# EAGLE schematic mikrophonie_2_r2 (EAGLE 6.5.0)
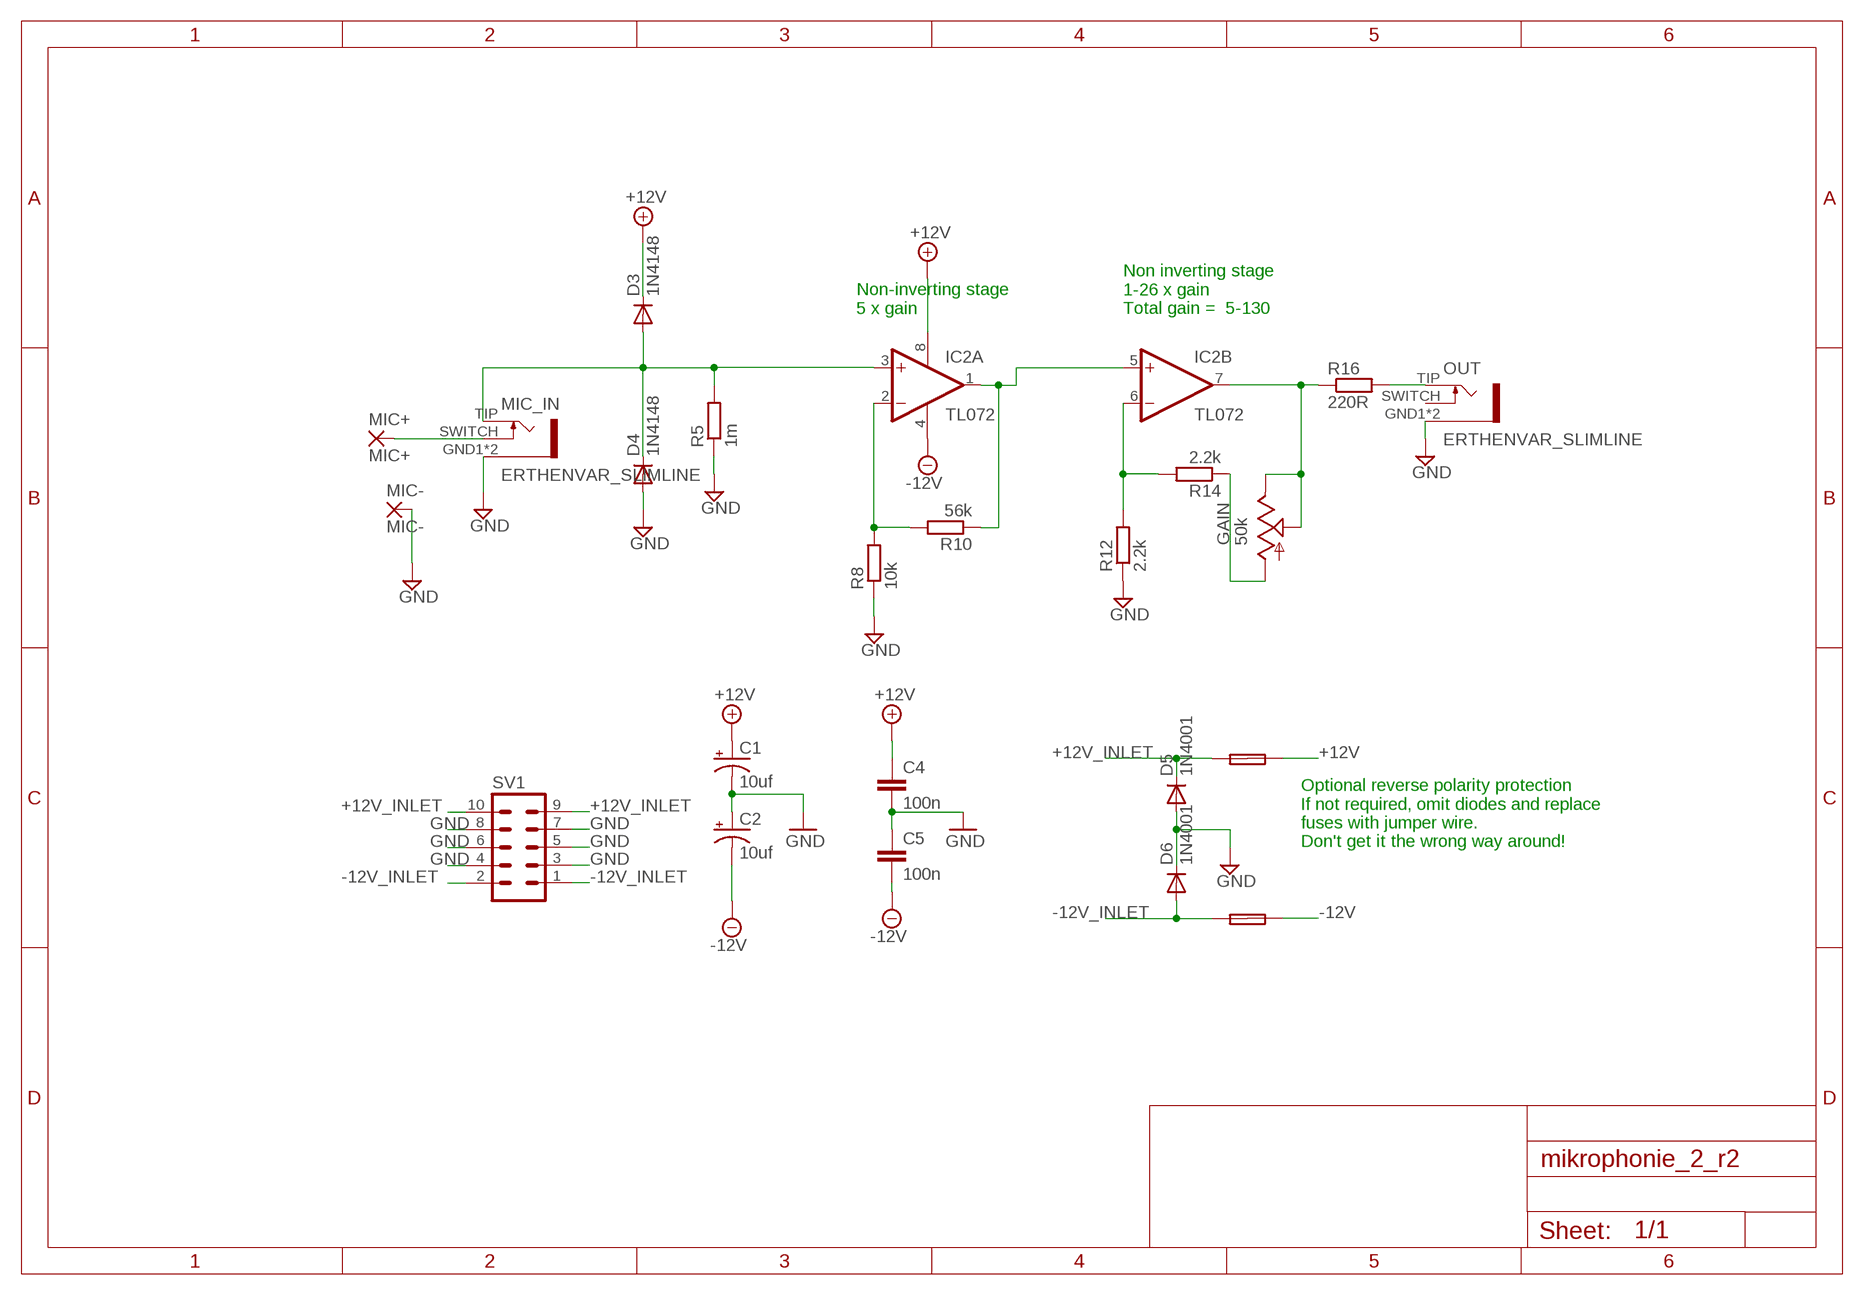
[diagram p0: schematic, sheet 1]

## Parts
1  FUSE  PTC_FUSEPOLY_FUSE  [C050H075X075]
C1  10uf  CAP_POLPTH2  [CPOL-RADIAL-10UF-25V]
C2  10uf  CAP_POLPTH2  [CPOL-RADIAL-10UF-25V]
C4  100n  C-EU050-024X044  [C050-024X044]
C5  100n  C-EU050-024X044  [C050-024X044]
D3  1N4148  1N4148DO35-7  [DO35-7]
D4  1N4148  1N4148DO35-7  [DO35-7]
D5  1N4001  1N4004  [DO41-10]
D6  1N4001  1N4004  [DO41-10]
FUSE  FUSE  PTC_FUSEPOLY_FUSE  [C050H075X075]
GAIN  50k  ALPHA-9MMF2A  [EVUF]
IC2  TL072  TL072P  [DIL08]
MIC+  MIC+  LONG_PAD_1  [LONG_PAD_1]
MIC-  MIC-  LONG_PAD_1  [LONG_PAD_1]
MIC_IN  ERTHENVAR_SLIMLINE  [ERTHENVAR_SLIMLINE]
OUT  ERTHENVAR_SLIMLINE  [ERTHENVAR_SLIMLINE]
R5  1m  R-EU_STANDARD_RESISTOR  [0207/10]
R8  10k  R-EU_STANDARD_RESISTOR  [0207/10]
R10  56k  R-EU_STANDARD_RESISTOR  [0207/10]
R12  2.2k  R-EU_STANDARD_RESISTOR  [0207/10]
R14  2.2k  R-EU_STANDARD_RESISTOR  [0207/10]
R16  220R  R-EU_STANDARD_RESISTOR  [0207/10]
SV1  10_PIN_HEADER  [MA05-2]

## Nets
+12V [power]: 1.2 C1.1(+) C4.1 D3.C IC2.8(P:V+)
+12V_INLET: 1.1 D5.C SV1.9 SV1.10
-12V [power]: C2.2(-) C5.2 FUSE.2 IC2.4(P:V-)
-12V_INLET: D6.A FUSE.1 SV1.1 SV1.2
GND [ground]: C1.2(-) C2.1(+) C4.2 C5.1 D4.A D5.A D6.C MIC-.P$1(P) MIC_IN.GND1 MIC_IN.GND2 OUT.GND1 OUT.GND2 R5.1 R8.1 R12.1 SV1.3 SV1.4 SV1.5 SV1.6 SV1.7 SV1.8
N$1: MIC+.P$1(P) MIC_IN.SWITCH
N$2: D3.A D4.C IC2.3(A:+IN) MIC_IN.TIP R5.2
N$3: IC2.2(A:-IN) R8.2 R10.2
N$4: IC2.1(A:OUT) IC2.5(B:+IN) R10.1
N$5: GAIN.1(A) R14.1
N$6: IC2.6(B:-IN) R12.2 R14.2
N$8: GAIN.2(S) GAIN.3(E) IC2.7(B:OUT) R16.1
N$10: OUT.TIP R16.2
Unconnected: OUT.SWITCH

## Notes on the sheet
- Non-inverting stage
  5 x gain
- Non inverting stage
  1-26 x gain
  Total gain =  5-130
- Optional reverse polarity protection
  If not required, omit diodes and replace
  fuses with jumper wire. 
  Don't get it the wrong way around!

## Library data of the parts
1 FUSE = TomW:PTC_FUSE
C1 C2 = SparkFun-Passives:CAP_POL: Capacitor Polarized These are standard SMD and PTH capacitors. Normally 10uF, 47uF, and 100uF in electrolytic and tantalum varieties. Always verify the external diameter of the through hole cap, it varies with capacity, voltage, and manufacturer. The EIA devices should be standard.
C4 C5 = TomW:C-EU: CAPACITOR, European symbol
D3 = TomW:1N4148: DIODE high speed (Philips)
D4 = diode:1N4148: DIODE high speed (Philips)
D5 D6 = diode:1N4004: DIODE general purpose rectifier, 1 A
GAIN = TomW:ALPHA-9MM: 9 mm Square Rotary Potentiometers Source: Panasonic
IC2 = TomW:TL072: OP AMP
MIC+ MIC- = TomW:LONG_PAD_1
MIC_IN OUT = TomW:ERTHENVAR_SLIMLINE
R5 R8 R10 R12 R14 R16 = TomW:R-EU_: RESISTOR, European symbol
SV1 = TomW:10_PIN_HEADER: PIN HEADER; OC_FARNELL: unknown; OC_NEWARK: unknown

## Net classes
0 default: width 0.61 mm
1 power: width 0.61 mm
2 ground: width 0.61 mm